# EAGLE design BlinkyBoard(New) (EAGLE 9.1.0)
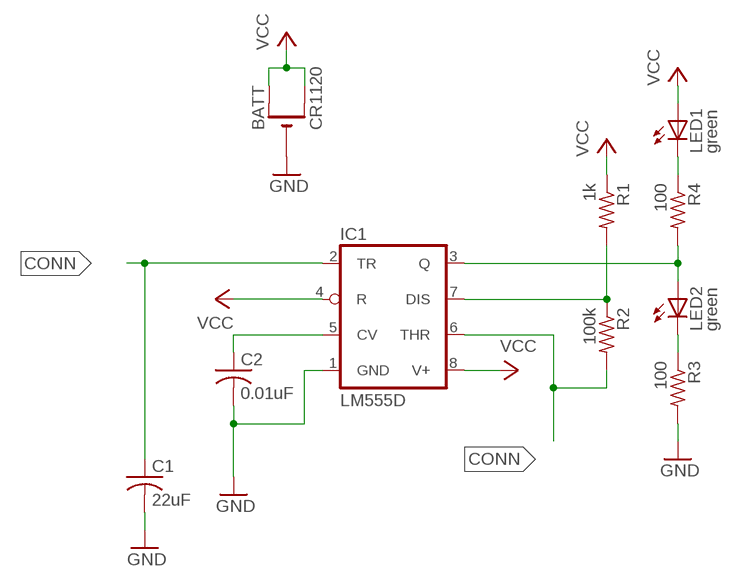
[diagram p0: schematic, sheet 1]

## Parts
BATT  CR1120  CR1220SMT  [CR1220-SMD]
C1  22uF  C-USC0805  [C0805]
C2  0.01uF  C-USC0805  [C0805]
IC1  LM555D  [SO08]
LED1  green  LEDCHIPLED_0805  [CHIPLED_0805]
LED2  green  LEDCHIPLED_0805  [CHIPLED_0805]
R1  1k  R-US_R0805  [R0805]
R2  100k  R-US_R0805  [R0805]
R3  100  R-US_R0805  [R0805]
R4  100  R-US_R0805  [R0805]

## Nets
CONN: C1.1 IC1.2(TR) IC1.6(THR) R2.2
GND: BATT.- C1.2 C2.2 IC1.1(GND) R3.2
N$1: LED1.C R4.1
N$2: IC1.3(Q) LED2.A R4.2
N$3: LED2.C R3.1
N$4: IC1.7(DIS) R1.2 R2.1
N$8: C2.1 IC1.5(CV)
VCC: BATT.+$1(+) BATT.+$2(+1) IC1.4(R) IC1.8(V+) LED1.A R1.1

## Library data of the parts
BATT = adafruit:CR1220: CR1216/CR1220/CR1225 12mm 3V lithium coin cell Great for battery packup. Both SMT and THM holders. Note the THM package has the ground pads on both sides of the PCB so that the masks are the same - this reduces the cost; OC_NEWARK: unknown
C1 = adafruit:C-US: CAPACITOR, American symbol; MF: AVX CORPORATION; MPN: 08056D226MAT2A; OC_NEWARK: 36K6864
C2 = adafruit:C-US: CAPACITOR, American symbol; MPN: C0805X103K1RAC3316; OC_NEWARK: 01AC1590
IC1 = adafruit:*555: TIMER Changed DIP package to have round (not oval) pin pads http://www.ladyada.net/library/pcb/eaglelibrary.html; MPN: NE555DR; OC_NEWARK: 05M4240
LED1 LED2 = adafruit:LED: LED OSRAM: - CHIPLED LG R971, LG N971, LY N971, LG Q971, LY Q971, LO R971, LY R971 LH N974, LH R974 LS Q976, LO Q976, LY Q976 LO Q996 - Hyper CHIPLED LW Q18S LB Q993, LB Q99A, LB R99A - SideLED LS A670, LO A670, LY A670, LG A670, LP A670 LB A673, LV A673, LT A673, LW A673 LH A674 LY A675 LS A676, LA A676, LO A676, LY A676, LW A676 LS A679, LY A679, LG A679 - Hyper Micro SIDELED® LS Y876, LA Y876, LO Y876, LY Y876 LT Y87S - SmartLED LW L88C, LW L88S LB L89C, LB L89S, LG L890 LS L89K, LO L89K, LY L89K LS L896, LA L896, LO L896, LY L896 - TOPLED LS T670, LO T670, LY T670, LG T670, LP T670 LSG T670, LSP T670, LSY T670, LOP T670, LYG T670 LG T671, LOG T671, LSG T671 LB T673, LV T673, LT T673, LW T673 LH T674 LS T676, LA T676, LO T676, LY T676, LB T676, LH T676, LSB T676, LW T676 LB T67C, LV T67C, LT T67C, LS T67K, LO T67K, LY T67K, LW E67C LS E67B, LA E67B, LO E67B, LY E67B, LB E67C, LV E67C, LT E67C LW T67C LS T679, LY T679, LG T679 LS T770, LO T770, LY T770, LG T770, LP T770 LB T773, LV T773, LT T773, LW T773 LH T774 LS E675, LA E675, LY E675, LS T675 LS T776, LA T776, LO T776, LY T776, LB T776 LHGB T686 LT T68C, LB T68C - Hyper Mini TOPLED® LB M676 - Mini TOPLED Santana® LG M470 LS M47K, LO M47K, LY M47K Source: http://www.osram.convergy.de/; MPN: MCL-S270GC; OC_NEWARK: 14N9356
R1 = adafruit:R-US_: RESISTOR, American symbol; MPN: CRCW08051K00FKTC; OC_NEWARK: 48P9976
R2 = adafruit:R-US_: RESISTOR, American symbol; MF: VISHAY/DALE; MPN: CRCW0805100KFKTA; OC_NEWARK: 05F1513
R3 R4 = adafruit:R-US_: RESISTOR, American symbol; MF: VISHAY/DALE; MPN: CRCW0805100RFKTA; OC_NEWARK: 05F1505

## Board
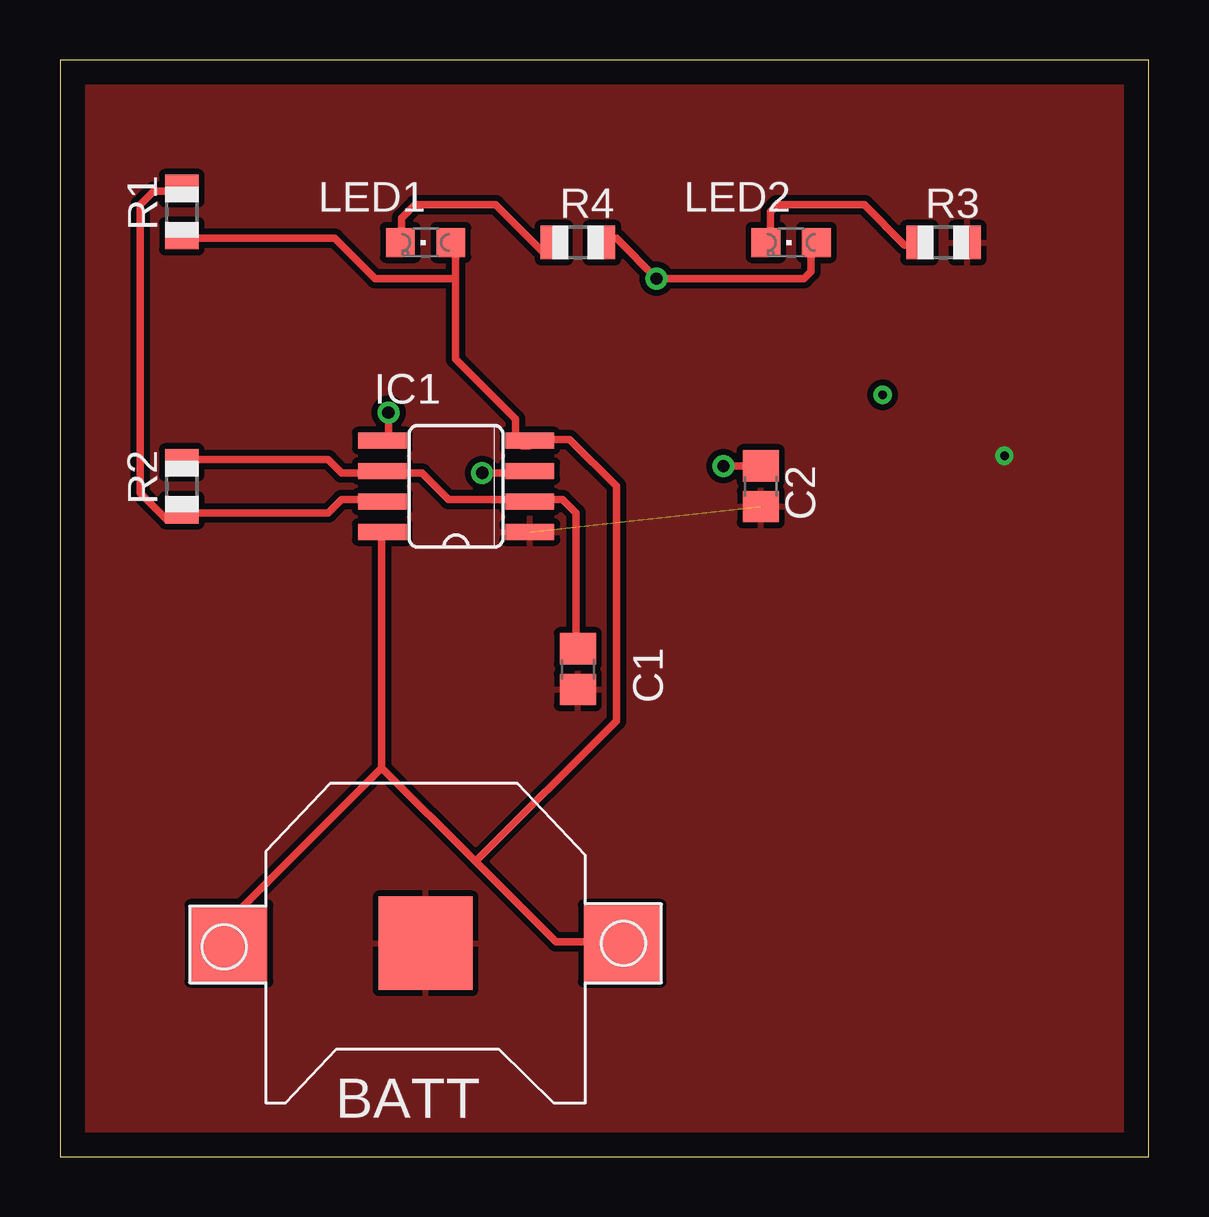
[diagram p1: board, top side]
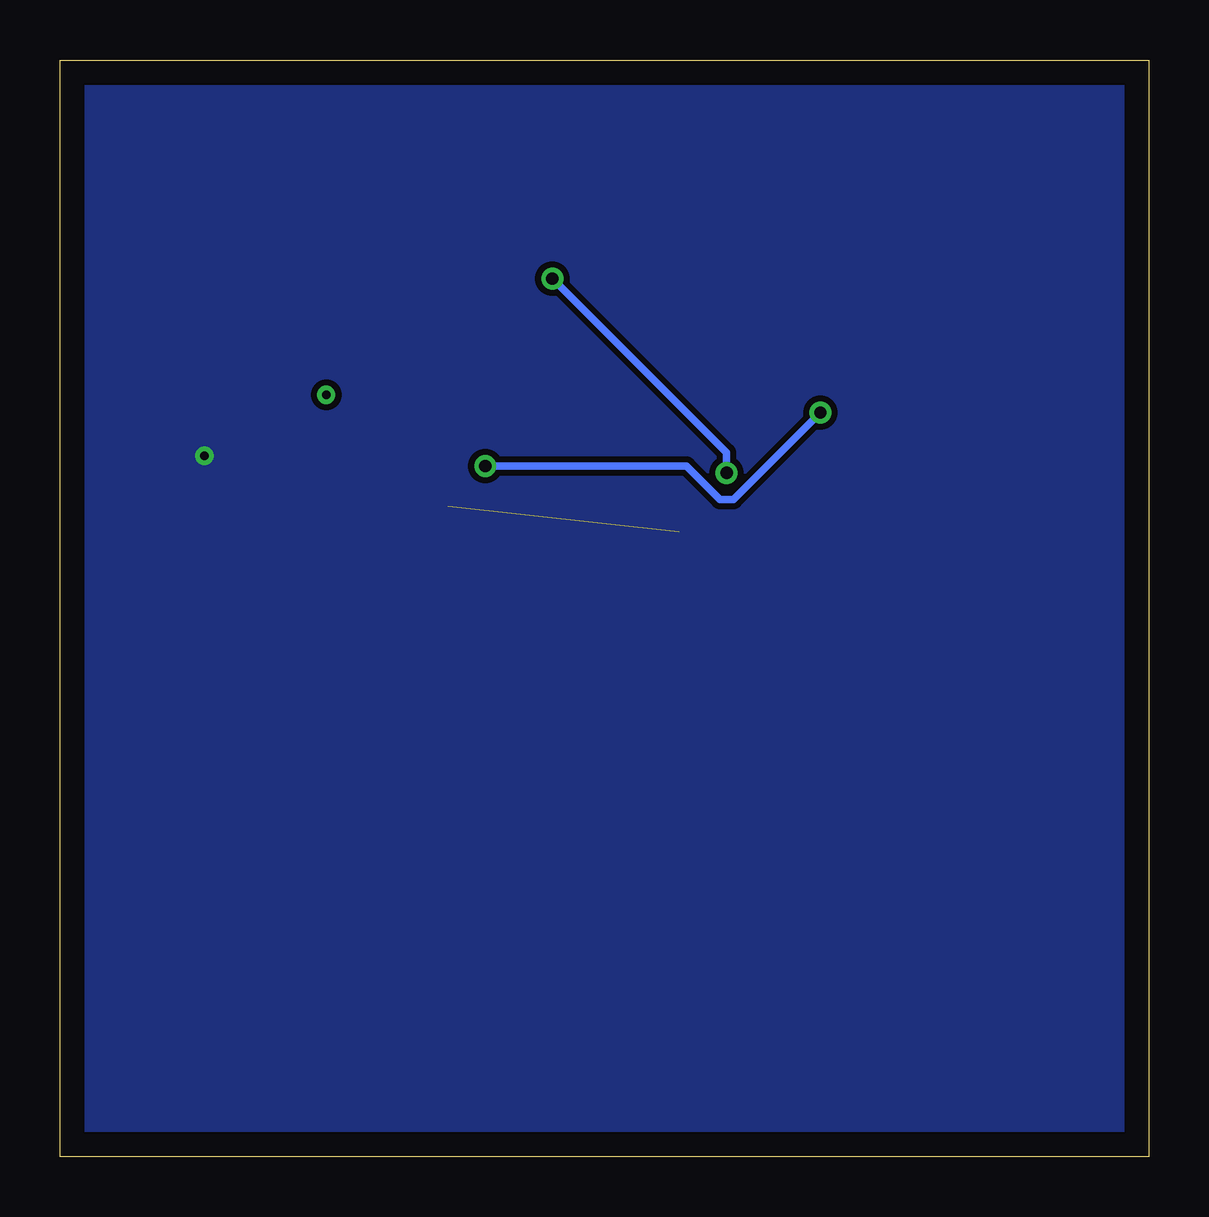
[diagram p2: board, bottom side, seen from below]

Size 45.39 x 45.71 mm. Coordinates in mm from the lower left corner, seen from the top.
Outline: 0,0 45.39,0 45.39,45.71 0,45.71 0,0
Copper layers (1*16): Top 0.035mm / dielectric 1.5mm / Bottom 0.035mm
Design rules "default": minimum track width 6mil, minimum drill 0.35mm, track to track 6mil, track to pad 6mil, pad to pad 6mil, via to via 6mil, smd to smd 6mil, copper to edge 40mil, drill to drill 6mil, minimum pad ring 10mil, minimum via ring 8mil, stop-mask expansion 4mil, vias tented up to drill 0mil, thermal gap 10mil

### Footprints (pad centres in the part's own frame; a part is rotated, then mirrored left to right if it is on the bottom)
CR1220-SMD = smd 3.2 x 3.2: +$1 -8.2,0; +$2 8.2,0 | smd 3.9 x 3.9: - 0,0
C0805 = smd 1.3 x 1.5: 1 -0.85,0; 2 0.85,0
SO08 = smd 0.66 x 2.032: 1 -1.905,-3.073; 2 -0.635,-3.073; 3 0.635,-3.073; 4 1.905,-3.073; 5 1.905,3.073; 6 0.635,3.073; 7 -0.635,3.073; 8 -1.905,3.073
CHIPLED_0805 = smd 1.2 x 1.2: A 0,-1.05; C 0,1.05
R0805 = smd 1.1 x 1.4: 1 -1,0; 2 1,0

### Placement (x,y rotation side)
BATT  15.24,8.89 180 top
C1  21.59,20.32 270 top
C2  29.21,27.94 270 top
IC1  16.51,27.94 90 top
LED1  15.24,38.1 90 top
LED2  30.48,38.1 90 top
R1  5.08,39.37 90 top
R2  5.08,27.94 90 top
R3  36.83,38.1 0 top
R4  21.59,38.1 0 top

### Tracks (layer width: path | path; a pad name or v marks a point on that pad's centre or on a via)
CONN
  Top 0.305: C1.1 21.51,21.23 21.51,26.82 20.95,27.38 19.84,27.38 IC1.2 19.56,27.38 16.2,27.38 15.09,28.5 13.69,28.5 IC1.6 13.41,28.5 11.73,28.5 11.18,29.06 5.31,29.06 R2.2
GND  (via drill 0.35)  (1 unrouted)
  other vias: 39.37,29.21
  pour Top: -1.27,46.99 46.99,46.99 46.99,45.72 46.99,-1.27 -1.27,-1.27
  pour Bottom: -1.27,46.99 46.99,46.99 46.99,-1.27 -1.27,-1.27
N$1
  Top 0.305: LED1.C 14.25,38.28 14.25,39.12 14.81,39.67 18.16,39.67 20.12,37.72 20.4,37.72 20.68,38 R4.1
N$2  (via drill 0.51)
  Top 0.305: LED2.A 31.29,38 31.29,36.88 31.01,36.6 v24.87,36.6 23.19,38.28 22.63,38.28 R4.2 | v17.6,28.5 19.56,28.5 IC1.3
  Bottom 0.305: v17.6,28.5 17.6,29.34 v24.87,36.6
N$3
  Top 0.305: LED2.C 29.62,38.28 29.62,39.4 29.9,39.67 33.53,39.67 35.2,38 35.76,38 R3.1
N$4
  Top 0.305: IC1.7 13.41,27.38 11.73,27.38 11.18,26.82 5.31,26.82 R2.1 5.03,26.82 4.75,26.54 4.47,26.54 3.35,27.66 3.35,39.67 3.91,40.23 5.03,40.23 R1.2
N$5  (via drill 0.35)
  other vias: 34.29,31.75
N$8  (via drill 0.51)
  Top 0.305: v27.66,28.78 29.06,28.78 C2.1 | v13.69,31.01 13.69,29.9 IC1.5
  Bottom 0.305: v27.66,28.78 19.28,28.78 17.88,27.38 17.32,27.38 v13.69,31.01
VCC
  Top 0.305: 16.48,36.6 16.48,33.25 19,30.73 19,29.9 19.28,29.62 19.56,29.62 IC1.4 19.84,29.9 21.23,29.9 23.19,27.94 23.19,18.16 17.32,12.29 | 16.48,36.6 16.48,38 LED1.A | 16.48,36.6 13.13,36.6 11.46,38.28 5.31,38.28 R1.1 | 13.41,16.2 13.41,25.98 IC1.8 | 13.41,16.2 7.26,10.06 7.26,8.94 BATT.+$2 | 13.41,16.2 17.32,12.29 | 17.32,12.29 20.68,8.94 23.19,8.94 BATT.+$1